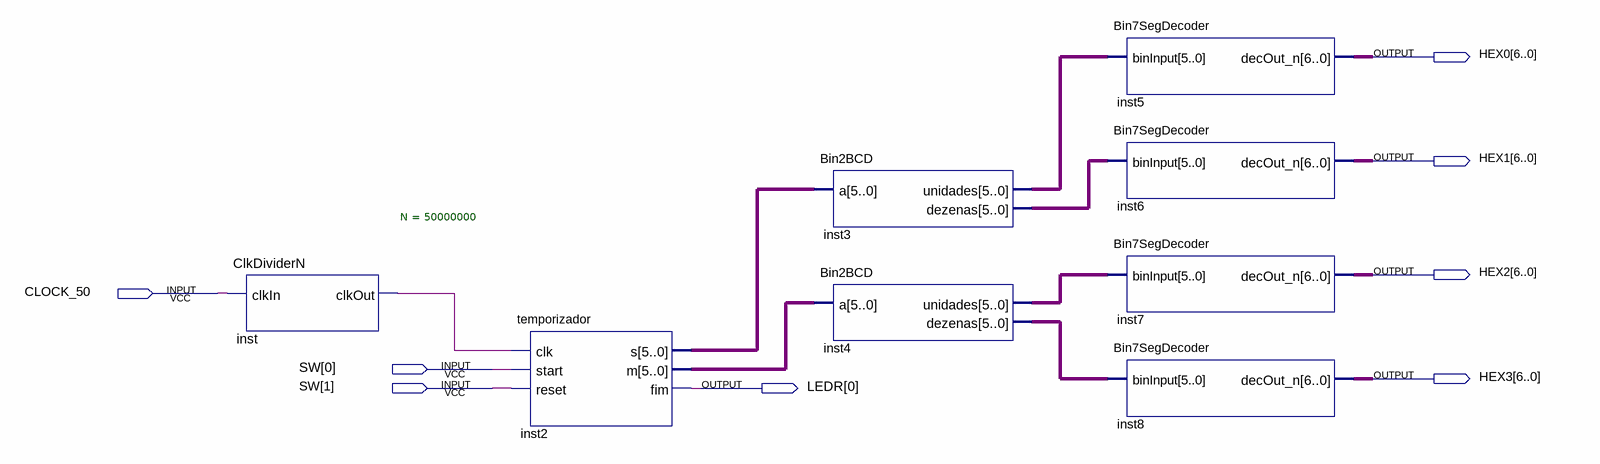
[diagram p0: schematic sheet]
// Quartus schematic counter.bdf as structural Verilog: 8 symbols, 8 pins
module counter (
  input  CLOCK_50,
  input  [1:0] SW,
  output [6:0] HEX0,
  output [6:0] HEX1,
  output [6:0] HEX2,
  output [6:0] HEX3,
  output [0:0] LEDR
);

  wire inst_clkout;
  wire [5:0] inst2_m, inst2_s, inst3_dezenas, inst3_unidades, inst4_dezenas, inst4_unidades;

  ClkDividerN #(.N(50000000)) inst (.clkIn(CLOCK_50), .clkOut(inst_clkout));
  temporizador inst2 (.clk(inst_clkout), .start(SW[0]), .reset(SW[1]), .s(inst2_s), .m(inst2_m), .fim(LEDR[0]));
  Bin2BCD inst3 (.a(inst2_s), .unidades(inst3_unidades), .dezenas(inst3_dezenas));
  Bin2BCD inst4 (.a(inst2_m), .unidades(inst4_unidades), .dezenas(inst4_dezenas));
  Bin7SegDecoder inst5 (.binInput(inst3_unidades), .decOut_n(HEX0));
  Bin7SegDecoder inst6 (.binInput(inst3_dezenas), .decOut_n(HEX1));
  Bin7SegDecoder inst7 (.binInput(inst4_unidades), .decOut_n(HEX2));
  Bin7SegDecoder inst8 (.binInput(inst4_dezenas), .decOut_n(HEX3));
endmodule
